# EAGLE design spiro (EAGLE 7.1.0)
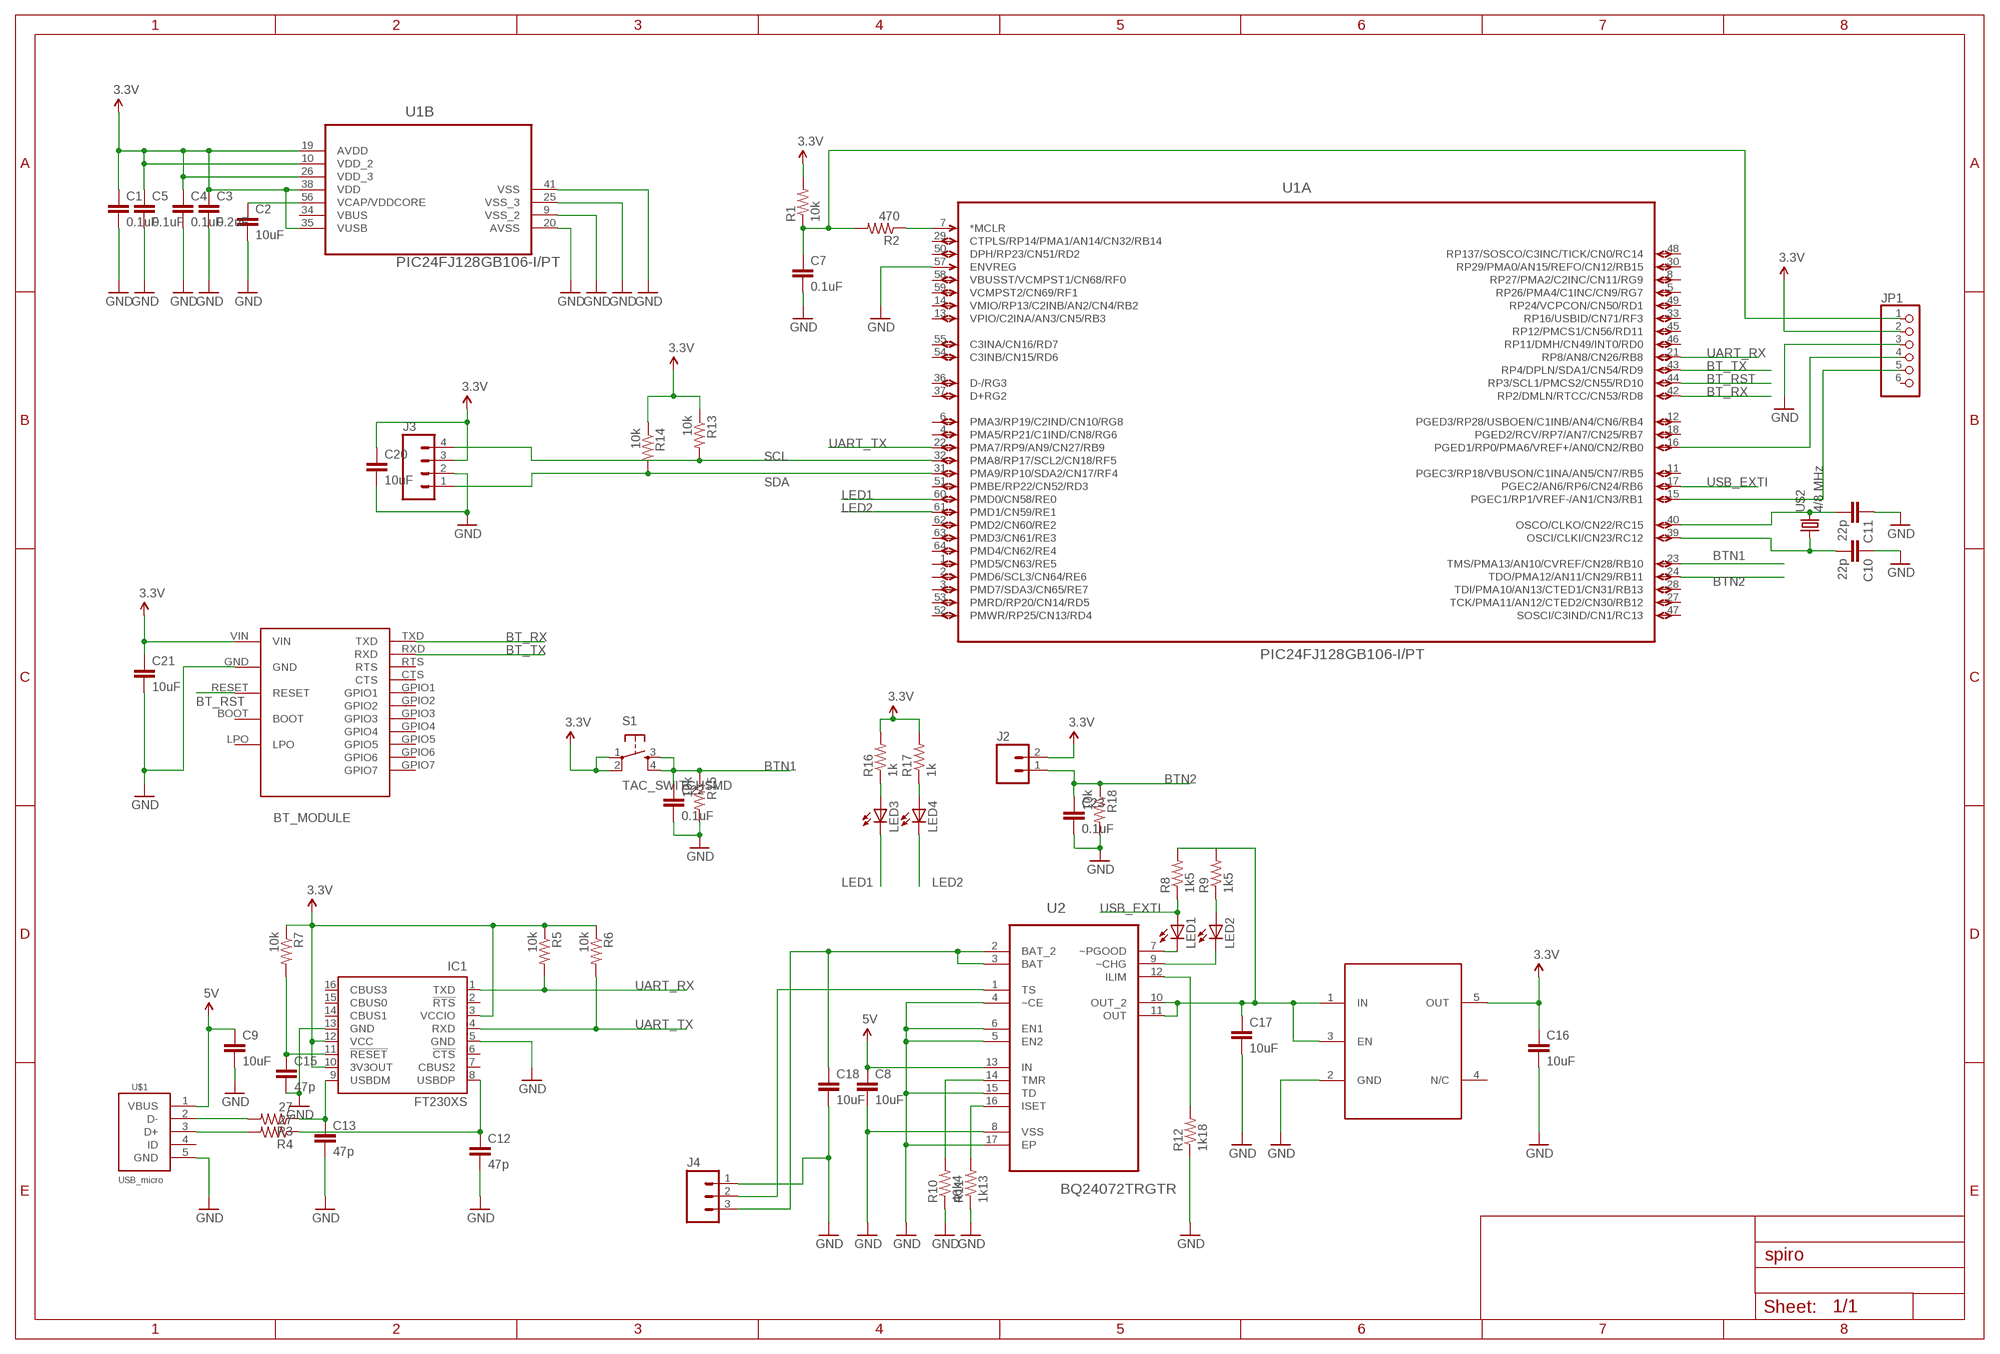
[diagram p0: schematic, sheet 1]

## Parts
BT_MODULE  BT_MODULE  SPBT2632C2A  [SPBT2632C2A]
C1  0.1uF  0.1UF-25V(+80/-20%)(0603)  [0603-CAP]
C2  10uF  10UF-6.3V-20%(1206)  [1206]
C3  0.2uF  0.1UF-25V(+80/-20%)(0603)  [0603-CAP]
C4  0.1uF  0.1UF-25V(+80/-20%)(0603)  [0603-CAP]
C5  0.1uF  0.1UF-25V(+80/-20%)(0603)  [0603-CAP]
C7  0.1uF  0.1UF-25V(+80/-20%)(0603)  [0603-CAP]
C8  10uF  10UF-6.3V-20%(1206)  [1206]
C9  10uF  10UF-6.3V-20%(1206)  [1206]
C10  22p  0.1UF-25V(+80/-20%)(0603)  [0603-CAP]
C11  22p  0.1UF-25V(+80/-20%)(0603)  [0603-CAP]
C12  47p  0.1UF-25V(+80/-20%)(0603)  [0603-CAP]
C13  47p  0.1UF-25V(+80/-20%)(0603)  [0603-CAP]
C15  47p  0.1UF-25V(+80/-20%)(0603)  [0603-CAP]
C16  10uF  10UF-6.3V-20%(1206)  [1206]
C17  10uF  10UF-6.3V-20%(1206)  [1206]
C18  10uF  10UF-6.3V-20%(1206)  [1206]
C20  10uF  10UF-6.3V-20%(1206)  [1206]
C21  10uF  10UF-6.3V-20%(1206)  [1206]
C22  0.1uF  0.1UF-25V(+80/-20%)(0603)  [0603-CAP]
C23  0.1uF  0.1UF-25V(+80/-20%)(0603)  [0603-CAP]
IC1  FT230XS  [SSOP16]
J2  M02PTH  [1X02]
J3  M04NO_SILK_ALL_ROUND  [1X04_NO_SILK_ALL_ROUND]
J4  M03  [1X03-SMD-50MILS]
JP1  PINHD-1X6  [1X06]
LED1  LEDCHIP-LED0603  [CHIP-LED0603]
LED2  LEDCHIP-LED0603  [CHIP-LED0603]
LED3  LEDCHIP-LED0603  [CHIP-LED0603]
LED4  LEDCHIP-LED0603  [CHIP-LED0603]
R1  10k  RESISTOR0603-RES  [0603-RES]
R2  470  RESISTOR0603-RES  [0603-RES]
R3  27  RESISTOR0603-RES  [0603-RES]
R4  27  RESISTOR0603-RES  [0603-RES]
R5  10k  RESISTOR0603-RES  [0603-RES]
R6  10k  RESISTOR0603-RES  [0603-RES]
R7  10k  RESISTOR0603-RES  [0603-RES]
R8  1k5  RESISTOR0603-RES  [0603-RES]
R9  1k5  RESISTOR0603-RES  [0603-RES]
R10  46k4  RESISTOR0603-RES  [0603-RES]
R11  1k13  RESISTOR0603-RES  [0603-RES]
R12  1k18  RESISTOR0603-RES  [0603-RES]
R13  10k  RESISTOR0603-RES  [0603-RES]
R14  10k  RESISTOR0603-RES  [0603-RES]
R15  10k  RESISTOR0603-RES  [0603-RES]
R16  1k  RESISTOR0603-RES  [0603-RES]
R17  1k  RESISTOR0603-RES  [0603-RES]
R18  10k  RESISTOR0603-RES  [0603-RES]
S1  TAC_SWITCHSMD  [TACTILE-SWITCH-SMD]
U1  PIC24FJ128GB106-I/PT  [QFP50P1200X1200X120-64N]
U2  BQ24072TRGTR  [QFN50P300X300X100-17N]
U$1  USB_micro  USB-CON-5PIN-105017-0001  [USB-MICRO-MOLEX-105017-0001]
U$2  4/8 MHz  CRYSTAL-2SMX  [CRYSTAL-SMD-6X3.5-2SMX]
U$3  LP3990  [SOT95P280X145-5N]

## Nets
3.3V: BT_MODULE.VIN C1.1 C3.1 C4.1 C5.1 C16.1 C20.1 C21.1 IC1.3(VCCIO) IC1.10(3V3OUT) IC1.12(VCC) J2.2 J3.3 JP1.2 R1.2 R5.1 R6.1 R7.1 R13.1 R14.1 R16.2 R17.2 S1.1 S1.2 U1.10(B:VDD_2) U1.19(B:AVDD) U1.26(B:VDD_3) U1.35(B:VUSB) U1.38(B:VDD) U$3.5(OUT)
5V: C8.1 C9.1 U2.13(IN) U$1.1(VBUS)
BT_RST: BT_MODULE.RESET U1.44(A:RP3/SCL1/PMCS2/CN55/RD10)
BT_RX: BT_MODULE.TXD U1.42(A:RP2/DMLN/RTCC/CN53/RD8)
BT_TX: BT_MODULE.RXD U1.43(A:RP4/DPLN/SDA1/CN54/RD9)
BTN1: C22.1 R15.1 S1.3 S1.4 U1.23(A:TMS/PMA13/AN10/CVREF/CN28/RB10)
BTN2: C23.1 J2.1 R18.1 U1.24(A:TDO/PMA12/AN11/CN29/RB11)
GND: BT_MODULE.GND C1.2 C2.2 C3.2 C4.2 C5.2 C7.2 C8.2 C9.2 C10.1 C11.1 C12.2 C13.2 C15.2 C16.2 C17.2 C18.2 C20.2 C21.2 C22.2 C23.2 IC1.5(GND) IC1.13(GND) J3.2 J4.1 JP1.3 R10.1 R11.1 R12.1 R15.2 R18.2 U1.9(B:VSS_2) U1.20(B:AVSS) U1.25(B:VSS_3) U1.41(B:VSS) U1.57(A:ENVREG) U2.4(~CE) U2.5(EN2) U2.6(EN1) U2.8(VSS) U2.15(TD) U2.17(EP) U$1.5(GND) U$3.2(GND)
LED1: LED3.C U1.60(A:PMD0/CN58/RE0)
LED2: LED4.C U1.61(A:PMD1/CN59/RE1)
N$1: C2.1 U1.56(B:VCAP/VDDCORE)
N$2: R4.2 U$1.3(D+)
N$3: C13.1 IC1.9(USBDM) R3.1
N$4: C12.1 IC1.8(USBDP) R4.1
N$5: R3.2 U$1.2(D-)
N$6: LED1.C U2.7(~PGOOD)
N$7: C7.1 JP1.1 R1.1 R2.2
N$8: R2.1 U1.7(A:*MCLR)
N$9: C11.2 U1.40(A:OSCO/CLKO/CN22/RC15) U$2.P$3
N$11: JP1.4 U1.16(A:PGED1/RP0/PMA6/VREF+/AN0/CN2/RB0)
N$12: C10.2 U1.39(A:OSCI/CLKI/CN23/RC12) U$2.P$1
N$13: JP1.5 U1.15(A:PGEC1/RP1/VREF-/AN1/CN3/RB1)
N$14: C17.1 R8.2 R9.2 U2.10(OUT_2) U2.11(OUT) U$3.1(IN) U$3.3(EN)
N$15: C15.1 IC1.11(!RESET) R7.2
N$16: LED2.A R9.1
N$17: J4.2 U2.1(TS)
N$18: C18.1 J4.3 U2.2(BAT_2) U2.3(BAT)
N$19: LED2.C U2.9(~CHG)
N$21: R11.2 U2.16(ISET)
N$22: R12.2 U2.12(ILIM)
N$23: R10.2 U2.14(TMR)
N$24: LED3.A R16.1
N$28: LED4.A R17.1
SCL: J3.4 R13.2 U1.32(A:PMA8/RP17/SCL2/CN18/RF5)
SDA: J3.1 R14.2 U1.31(A:PMA9/RP10/SDA2/CN17/RF4)
UART_RX: IC1.1(TXD) R5.2 U1.21(A:RP8/AN8/CN26/RB8)
UART_TX: IC1.4(RXD) R6.2 U1.22(A:PMA7/RP9/AN9/CN27/RB9)
USB_EXTI: LED1.A R8.1 U1.17(A:PGEC2/AN6/RP6/CN24/RB6)
Unconnected: BT_MODULE.BOOT BT_MODULE.CTS BT_MODULE.GPIO1 BT_MODULE.GPIO2 BT_MODULE.GPIO3 BT_MODULE.GPIO4 BT_MODULE.GPIO5 BT_MODULE.GPIO6 BT_MODULE.GPIO7 BT_MODULE.LPO BT_MODULE.RTS IC1.2(!RTS) IC1.6(!CTS) IC1.7(CBUS2) IC1.14(CBUS1) IC1.15(CBUS0) IC1.16(CBUS3) JP1.6 U1.1(A:PMD5/CN63/RE5) U1.2(A:PMD6/SCL3/CN64/RE6) U1.3(A:PMD7/SDA3/CN65/RE7) U1.4(A:PMA5/RP21/C1IND/CN8/RG6) U1.5(A:RP26/PMA4/C1INC/CN9/RG7) U1.6(A:PMA3/RP19/C2IND/CN10/RG8) U1.8(A:RP27/PMA2/C2INC/CN11/RG9) U1.11(A:PGEC3/RP18/VBUSON/C1INA/AN5/CN7/RB5) U1.12(A:PGED3/RP28/USBOEN/C1INB/AN4/CN6/RB4) U1.13(A:VPIO/C2INA/AN3/CN5/RB3) U1.14(A:VMIO/RP13/C2INB/AN2/CN4/RB2) U1.18(A:PGED2/RCV/RP7/AN7/CN25/RB7) U1.27(A:TCK/PMA11/AN12/CTED2/CN30/RB12) U1.28(A:TDI/PMA10/AN13/CTED1/CN31/RB13) U1.29(A:CTPLS/RP14/PMA1/AN14/CN32/RB14) U1.30(A:RP29/PMA0/AN15/REFO/CN12/RB15) U1.33(A:RP16/USBID/CN71/RF3) U1.36(A:D-/RG3) U1.37(A:D+RG2) U1.45(A:RP12/PMCS1/CN56/RD11) U1.46(A:RP11/DMH/CN49/INT0/RD0) U1.47(A:SOSCI/C3IND/CN1/RC13) U1.48(A:RP137/SOSCO/C3INC/TICK/CN0/RC14) U1.49(A:RP24/VCPCON/CN50/RD1) U1.50(A:DPH/RP23/CN51/RD2) U1.51(A:PMBE/RP22/CN52/RD3) U1.52(A:PMWR/RP25/CN13/RD4) U1.53(A:PMRD/RP20/CN14/RD5) U1.54(A:C3INB/CN15/RD6) U1.55(A:C3INA/CN16/RD7) U1.58(A:VBUSST/VCMPST1/CN68/RF0) U1.59(A:VCMPST2/CN69/RF1) U1.62(A:PMD2/CN60/RE2) U1.63(A:PMD3/CN61/RE3) U1.64(A:PMD4/CN62/RE4) U$1.4(ID) U$3.4(N/C)

## Notes on the sheet
- BT_MODULE

## Power pins joined to a net without a drawn wire
VBUS: U1.34(B:VBUS)

## Library data of the parts
BT_MODULE = SPBT2632C2A:SPBT2632C2A
C1 C4 C5 C7 C22 C23 = SparkFun-Capacitors:0.1UF-25V(+80/-20%)(0603): CAP-00810 Ceramic Standard decoupling cap; PROD_ID: CAP-00810
C2 C8 C9 C16-C18 C20 C21 = SparkFun-Capacitors:10UF-6.3V-20%(1206): CAP-10057 Ceramic; PROD_ID: CAP-10057
C3 C10-C13 C15 = SparkFun-Capacitors:0.1UF-25V(+80/-20%)(0603): CAP-00810 Ceramic Standard decoupling cap; PROD_ID: CAP-00810; VALUE: 0.1uF
IC1 = ftdi:FT230X: USB to BASIC UART IC Auto generated by make-symbol-device-package-bsdl.ulp Rev. 43 Source: Data sheet <http://www.ftdichip.com/Support/Documents/DataSheets/ICs/DS_FT230X.pdf>
J2 = SparkFun-Connectors:M02: Standard 2-pin 0.1" header. Use with - straight break away headers ( PRT-00116) - right angle break away headers (PRT-00553) - swiss pins (PRT-00743) - machine pins (PRT-00117) - female headers (PRT-00115) Molex polarized connector foot print use with: PRT-08233 with associated crimp pins and housings. 2.54_SCREWTERM for use with PRT-10571. 3.5mm Screw Terminal footprints for PRT-08084 5mm Screw Terminal footprints for use with PRT-08432
J3 = SparkFun-Connectors:M04: Header 4 Standard 4-pin 0.1" header. Use with straight break away headers (SKU : PRT-00116), right angle break away headers (PRT-00553), swiss pins (PRT-00743), machine pins (PRT-00117), and female headers (PRT-00115). Molex polarized connector foot print use with SKU : PRT-08231 with associated crimp pins and housings. 1MM SMD Version SKU: PRT-10208; PROD_ID: CONN-09696
J4 = SparkFun-Connectors:M03: Header 3 Standard 3-pin 0.1" header. Use with straight break away headers (SKU : PRT-00116), right angle break away headers (PRT-00553), swiss pins (PRT-00743), machine pins (PRT-00117), and female headers (PRT-00115). Molex polarized connector foot print use with SKU : PRT-08232 with associated crimp pins and housings.
JP1 = adafruit:PINHD-1X6: PIN HEADER
LED1-LED4 = adafruit:LED: LED OSRAM: - CHIPLED LG R971, LG N971, LY N971, LG Q971, LY Q971, LO R971, LY R971 LH N974, LH R974 LS Q976, LO Q976, LY Q976 LO Q996 - Hyper CHIPLED LW Q18S LB Q993, LB Q99A, LB R99A - SideLED LS A670, LO A670, LY A670, LG A670, LP A670 LB A673, LV A673, LT A673, LW A673 LH A674 LY A675 LS A676, LA A676, LO A676, LY A676, LW A676 LS A679, LY A679, LG A679 - Hyper Micro SIDELED® LS Y876, LA Y876, LO Y876, LY Y876 LT Y87S - SmartLED LW L88C, LW L88S LB L89C, LB L89S, LG L890 LS L89K, LO L89K, LY L89K LS L896, LA L896, LO L896, LY L896 - TOPLED LS T670, LO T670, LY T670, LG T670, LP T670 LSG T670, LSP T670, LSY T670, LOP T670, LYG T670 LG T671, LOG T671, LSG T671 LB T673, LV T673, LT T673, LW T673 LH T674 LS T676, LA T676, LO T676, LY T676, LB T676, LH T676, LSB T676, LW T676 LB T67C, LV T67C, LT T67C, LS T67K, LO T67K, LY T67K, LW E67C LS E67B, LA E67B, LO E67B, LY E67B, LB E67C, LV E67C, LT E67C LW T67C LS T679, LY T679, LG T679 LS T770, LO T770, LY T770, LG T770, LP T770 LB T773, LV T773, LT T773, LW T773 LH T774 LS E675, LA E675, LY E675, LS T675 LS T776, LA T776, LO T776, LY T776, LB T776 LHGB T686 LT T68C, LB T68C - Hyper Mini TOPLED® LB M676 - Mini TOPLED Santana® LG M470 LS M47K, LO M47K, LY M47K Source: http://www.osram.convergy.de/
R1-R18 = SparkFun-Passives:RESISTOR: Resistor Basic schematic elements and footprints for 0603, 1206, and PTH resistors.
S1 = SparkFun-Retired:TAC_SWITCH: Momentary Switch Button commonly used for reset or general input. Spark Fun Electronics SKU : COM-00097 SMT- SWCH-08247; PROD_ID: SWCH-08247
U1 = Microchip_By_element14_Batch_1:PIC24FJ128GB106-I/PT: IC, 16BIT MCU; MPN: PIC24FJ128Gb106-I/PT; OC_FARNELL: 1576850; OC_NEWARK: 54M5097; PACKAGE: TQFP-64; SUPPLIER: Microchip
U2 = Texas Instruments_By_element14_Batch_1:BQ24072TRGTR: 1.5A USB-Friendly Li-Ion Battery Charger and Power-Path Management IC; MPN: BQ24072TRGTR; OC_FARNELL: -; OC_NEWARK: 74R6078; PACKAGE: QFN-16; SUPPLIER: Texas Instruments
U$1 = GeekAmmo:USB-CON-5PIN: Molex Micro USB 105017-0001
U$2 = SparkFun-FreqCtrl:CRYSTAL-2SMX
U$3 = Texas Instruments_By_element14_Batch_1:LP3990

## Board
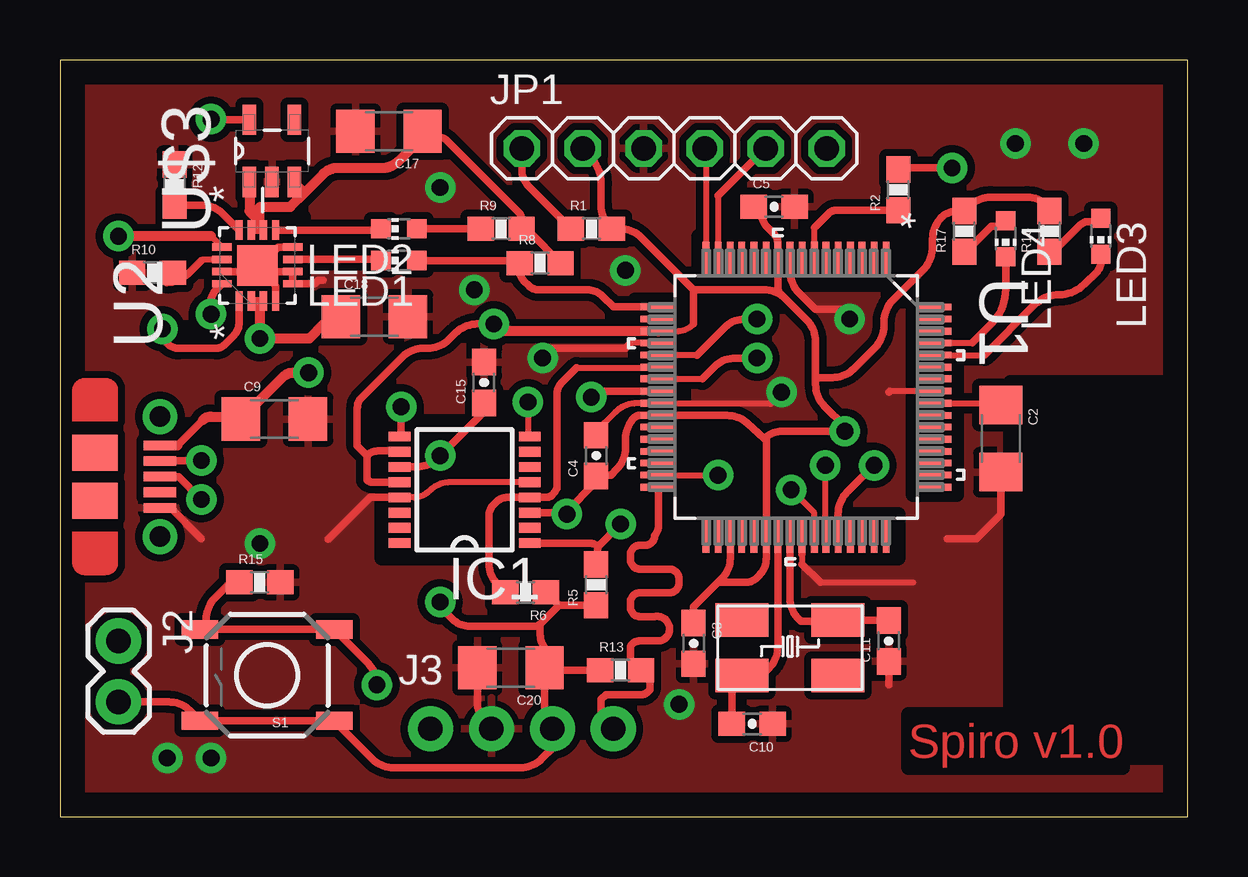
[diagram p1: board, top side]
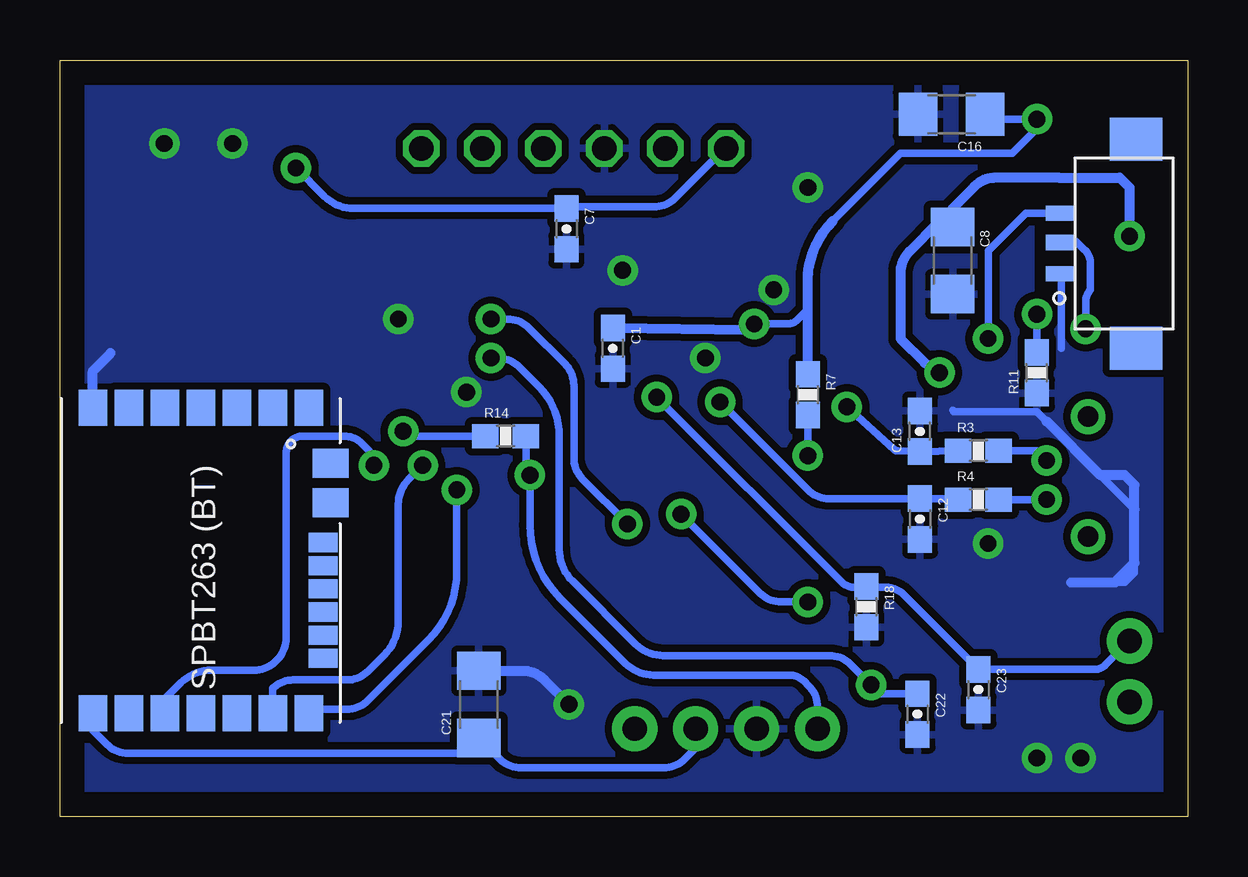
[diagram p2: board, bottom side, seen from below]

Size 47.02 x 31.52 mm. Coordinates in mm from the lower left corner, seen from the top.
Outline: 0,0 47.02,0 47.02,31.52 0,31.52 0,0
Copper layers (1*16): Top 0.035mm / dielectric 1.5mm / Bottom 0.035mm
Design rules "default": minimum track width 10mil, minimum drill 24mil, track to track 8mil, track to pad 8mil, pad to pad 8mil, via to via 8mil, smd to smd 8mil, copper to edge 40mil, drill to drill 8mil, minimum pad ring 10mil, minimum via ring 8mil, stop-mask expansion 4mil, vias tented up to drill 0mil, thermal gap 10mil
tRestrict: area 6.3,20.9 to 10.2,25; area 13.4,10.8 to 20.3,16.5; area 39.6,3.5 to 46.5,18.1; area 26.6,22.1 to 35,24.2; area 24,13.4 to 26,21.5; area 26.6,10.8 to 35,12.6; area 35.6,13.4 to 37.4,21.5; area 35.4,2 to 44.3,4.3; area 20.9,13.4 to 24.2,17.5
bRestrict: area 39.6,4.1 to 46.5,17.1; area 0.2,21.1 to 6.1,27.2

### Footprints (pad centres in the part's own frame; a part is rotated, then mirrored left to right if it is on the bottom)
SPBT2632C2A = smd 1.2 x 1.5: BOOT 3,6.37; CTS 0,6.37; GND 4.5,-6.37; GPIO1 -4.5,-6.37; GPIO2 -3,-6.37; GPIO3 -1.5,-6.37; GPIO4 0,-6.37; GPIO5 1.5,-6.37; GPIO6 3,-6.37; RESET 1.5,6.37; RTS -1.5,6.37; RXD -3,6.37; TXD -4.5,6.37; VIN 4.5,6.37 | smd 1.5 x 1.2: GPIO7 -5.4,-4.05; LPO -5.4,-2.4 | smd 1.2 x 0.8: NC -5.1,4.075; NC1 -5.1,3.11; NC2 -5.1,2.145; NC3 -5.1,1.18; NC4 -5.1,0.215; NC5 -5.1,-0.75
0603-CAP = smd 1.1 x 1: 1 -0.85,0; 2 0.85,0
1206 = smd 1.6 x 1.8: 1 -1.4,0; 2 1.4,0
SSOP16 = smd 0.914 x 0.406: 1 -2.718,2.223; 2 -2.718,1.587; 3 -2.718,0.953; 4 -2.718,0.318; 5 -2.718,-0.318; 6 -2.718,-0.953; 7 -2.718,-1.587; 8 -2.718,-2.223; 9 2.718,-2.223; 10 2.718,-1.587; 11 2.718,-0.953; 12 2.718,-0.318; 13 2.718,0.318; 14 2.718,0.953; 15 2.718,1.587; 16 2.718,2.223
1X02 = drill 1.016 pad 1.88: 1 0,0; 2 2.54,0
1X04_NO_SILK_ALL_ROUND = drill 1.016 pad 1.88: 1 0,0; 2 2.54,0; 3 5.08,0; 4 7.62,0
1X03-SMD-50MILS = smd 0.635 x 1.27: 1 2.299,4.674; 2 3.599,4.674; 3 4.813,4.674 | smd 1.803 x 2.184: MEC1 -0.813,1.549; MEC2 7.899,1.549
1X06 = drill 1.016 octagon: 1 -6.35,0; 2 -3.81,0; 3 -1.27,0; 4 1.27,0; 5 3.81,0; 6 6.35,0
CHIP-LED0603 = smd 0.8 x 0.8: A 0,-0.75; C 0,0.75
0603-RES = smd 1.1 x 1: 1 -0.85,0; 2 0.85,0
TACTILE-SWITCH-SMD = smd 1.524 x 0.762: 1 -2.794,1.905; 2 2.794,1.905; 3 -2.794,-1.905; 4 2.794,-1.905
QFP50P1200X1200X120-64N = smd 1.473 x 0.279: 1 -5.74,3.759; 2 -5.74,3.251; 3 -5.74,2.743; 4 -5.74,2.261; 5 -5.74,1.753; 6 -5.74,1.245; 7 -5.74,0.762; 8 -5.74,0.254; 9 -5.74,-0.254; 10 -5.74,-0.762; 11 -5.74,-1.245; 12 -5.74,-1.753; 13 -5.74,-2.261; 14 -5.74,-2.743; 15 -5.74,-3.251; 16 -5.74,-3.759; 33 5.74,-3.759; 34 5.74,-3.251; 35 5.74,-2.743; 36 5.74,-2.261; 37 5.74,-1.753; 38 5.74,-1.245; 39 5.74,-0.762; 40 5.74,-0.254; 41 5.74,0.254; 42 5.74,0.762; 43 5.74,1.245; 44 5.74,1.753; 45 5.74,2.261; 46 5.74,2.743; 47 5.74,3.251; 48 5.74,3.759 | smd 0.279 x 1.473: 17 -3.759,-5.74; 18 -3.251,-5.74; 19 -2.743,-5.74; 20 -2.261,-5.74; 21 -1.753,-5.74; 22 -1.245,-5.74; 23 -0.762,-5.74; 24 -0.254,-5.74; 25 0.254,-5.74; 26 0.762,-5.74; 27 1.245,-5.74; 28 1.753,-5.74; 29 2.261,-5.74; 30 2.743,-5.74; 31 3.251,-5.74; 32 3.759,-5.74; 49 3.759,5.74; 50 3.251,5.74; 51 2.743,5.74; 52 2.261,5.74; 53 1.753,5.74; 54 1.245,5.74; 55 0.762,5.74; 56 0.254,5.74; 57 -0.254,5.74; 58 -0.762,5.74; 59 -1.245,5.74; 60 -1.753,5.74; 61 -2.261,5.74; 62 -2.743,5.74; 63 -3.251,5.74; 64 -3.759,5.74
QFN50P300X300X100-17N = smd 0.813 x 0.305: 1 -1.473,0.762; 2 -1.473,0.254; 3 -1.473,-0.254; 4 -1.473,-0.762; 9 1.473,-0.762; 10 1.473,-0.254; 11 1.473,0.254; 12 1.473,0.762 | smd 0.305 x 0.813: 5 -0.762,-1.473; 6 -0.254,-1.473; 7 0.254,-1.473; 8 0.762,-1.473; 13 0.762,1.473; 14 0.254,1.473; 15 -0.254,1.473; 16 -0.762,1.473 | smd 1.702 x 1.702: 17 0,0
USB-MICRO-MOLEX-105017-0001 = smd 0.4 x 1.35: 1 1.2,0; 2 1.85,0; 3 2.5,0; 4 3.15,0; 5 3.8,0 | drill 0.85 pad 1.45: P$1 0,0; P$2 5,0 | smd 1.5 x 1.9: P$3 3.5,-2.7; P$4 1.5,-2.7
CRYSTAL-SMD-6X3.5-2SMX = smd 2.2 x 1.4: P$1 1,0.6; P$2 5,0.6; P$3 5,2.9; P$4 1,2.9
SOT95P280X145-5N = smd 1.27 x 0.559: 1 -1.295,0.94; 2 -1.295,0; 3 -1.295,-0.94; 4 1.295,-0.94; 5 1.295,0.94

### Placement (x,y rotation side)
BT_MODULE  41.15,10.67 180 bottom
C1  23.98,19.51 270 bottom
C2  39.22,15.75 270 top
C3  26.42,7.21 270 top
C4  22.35,15.04 90 top
C5  29.77,25.4 0 top
C7  25.91,24.49 270 bottom
C8  9.81,23.17 270 bottom
C9  8.94,16.56 0 top
C10  28.85,3.86 180 top
C11  34.54,7.32 90 top
C12  11.18,12.4 270 bottom
C13  11.18,16.05 90 bottom
C15  17.68,18.08 90 top
C16  9.86,29.26 180 bottom
C17  13.72,28.55 180 top
C18  13.11,20.83 0 top
C20  18.8,6.2 180 top
C21  29.57,4.67 90 bottom
C22  11.28,4.27 270 bottom
C23  8.74,5.28 270 bottom
IC1  16.87,13.61 180 top
J2  2.44,7.32 270 top
J3  15.44,3.66 0 top
J4  0.61,20.32 90 bottom
JP1  25.6,27.84 0 top
LED1  14.12,23.16 90 top
LED2  14.12,24.49 90 top
LED3  43.38,24.18 180 top
LED4  39.42,24.08 180 top
R1  22.15,24.49 0 top
R2  34.95,26.11 90 top
R3  8.74,15.24 0 bottom
R4  8.74,13.21 0 bottom
R5  22.35,9.65 90 top
R6  19.41,9.35 180 top
R7  15.85,17.58 270 bottom
R8  20.02,23.06 0 top
R9  18.39,24.49 0 top
R10  3.86,22.66 0 top
R11  6.3,18.49 90 bottom
R12  4.78,26.31 270 top
R13  23.37,6.1 0 top
R14  28.45,15.85 0 bottom
R15  8.33,9.75 0 top
R16  41.25,24.38 90 top
R17  37.69,24.38 90 top
R18  13.41,8.74 270 bottom
S1  8.64,5.89 180 top
U1  30.68,17.48 270 top
U2  8.23,22.96 90 top
U$1  4.17,16.66 270 top
U$2  27.43,5.28 0 top
U$3  8.84,27.74 90 top

### Tracks (layer width: path | path; a pad name or v marks a point on that pad's centre or on a via)
3.3V  (via drill 0.7 pad 1.27)
  Top 0.203: U1.38 29.46,11.71 29.46,10.97
  Top 0.254: U1.19 25.68,20.22 arc45 26.42,20.52
  Top 0.305: U$3.5 6.53,29.03 v6.3,29.06 | C20.1 20.2,4.7 arc45 20.52,3.91 J3.3 20.52,2.95 20.57,2.9 20.08,2.4 arc-45 19.18,2.03 13.91,2.03 arc-45 13.01,2.4 S1.1 S1.2 5.43,4.4 arc45 4.53,4.78 J2.2 | 29.36,15.75 28.66,16.39 arc42 27.81,16.71 U1.26 24.15,16.71 arc45 23.94,16.63 arc45 23.57,15.73 23.57,15.36 arc-45 23.2,14.46 22.96,14.22 22.39,14.22 C4.1 22.35,13.95 21.07,12.66 | R16.2 41.25,25.4 41.22,25.43 arc45 40.32,25.81 38.79,25.81 arc45 37.89,25.43 R17.2 37.41,25.23 arc45 36.74,24.96 arc45 36.37,24.06 36.37,23.78 arc-45 35.94,22.73 34.71,21.5 arc45 34.34,20.61 34.34,20.44 arc-45 33.97,19.54 33.09,18.66 arc-45 32.19,18.29 31.5,18.29 | JP1.2 21.79,27.79 22.1,27.48 arc-45 22.55,26.39 22.55,25.45 arc45 22.93,24.56 R1.2 23.35,24.49 arc-45 24.25,24.11 26.42,21.95 | 26.42,21.95 29.34,21.95 arc-45 30.24,21.57 | 30.24,21.57 31.12,20.69 arc-45 31.5,19.79 31.5,18.29 | 31.5,18.29 31.5,18 arc45 31.87,17.1 32.72,16.26 v32.72,16.05 | 26.42,21.95 26.42,20.52 | v21.13,12.6 21.07,12.66 | 21.07,12.66 IC1.3 | R6.1 20.8,8.8 | 20.8,8.8 R5.1 22.19,8.8 | C20.1 20.3,6.91 arc-45 20.02,7.58 20.02,8.02 | C20.1 20.3,6.1 R13.1 | 20.8,8.8 20.02,8.02 | 20.02,8.02 arc-45 19.79,7.92 17.08,7.92 arc-45 16.36,8.22 15.85,8.74 v15.85,8.94 | IC1.12 13.02,13.93 arc-45 12.8,14.02 12.8,15.04 | 12.8,15.04 arc-45 13.29,15.24 14.11,15.24 IC1.10 | 12.8,15.04 12.39,15.44 12.39,17.03 arc-45 12.56,17.44 14.27,19.14 arc-45 15.14,19.51 15.32,19.51 arc45 16.23,19.88 16.49,20.15 arc-45 17.39,20.52 v18.09,20.52 | 29.36,15.75 29.44,15.67 U1.38 29.44,10.76 arc-45 29.14,10.04 29.04,9.94 arc-45 28.59,9.75 27.43,9.75
  Top 0.305: 29.36,15.75 arc-45 30.1,16.05 v32.72,16.05 | 32.92,15.85 v32.72,16.05 | C3.1 26.42,8.74 27.43,9.75 | U1.35 27.94,10.77 arc-45 27.58,9.9 27.43,9.75 | C5.1 29.26,25.06 29.26,25.06 arc45 29.45,24.6 29.74,24.31 arc-45 29.92,23.88 U1.10 29.92,22.05 arc45 30.04,21.78 30.24,21.57
  Top 0.406: 18.39,20.22 arc-90 v18.09,20.52 arc90 18.39,20.22 | U1.19 18.39,20.22
  Bottom 0.305: BT_MODULE.VIN 45.65,3.59 45.08,3.01 arc-45 44.18,2.64 30.2,2.64 C21.1 28.7,2.4 arc-45 27.8,2.03 21.86,2.03 arc-45 20.96,2.4 20.52,2.85 J3.3 | 29.5,16.05 R14.1 32.23,15.85 arc45 v32.72,16.05 | v15.85,8.94 16.95,8.94 arc45 17.85,9.31 v21.13,12.6 | v18.09,20.52 16.7,20.52 arc-45 16.29,20.69 15.85,21.13 | 14.81,24.82 11.99,27.64 7.32,27.64 6.3,28.65 v6.3,29.06 8.25,29.06 C16.1
  Bottom 0.406: R7.1 15.85,21.13 15.85,22.3 arc45 14.81,24.82 | C1.1 18.32,20.28 arc-90 v18.09,20.52
5V  (via drill 0.7 pad 1.27)
  Top 0.254: 6.3,24.18 U2.13
  Top 0.305: 4.9,15.46 5.96,16.53 | 7.44,16.66 C9.1
  Top 0.406: 6.3,24.18 v2.44,24.18 | U$1.1 4.9,15.46 | 5.96,16.53 arc-45 6.28,16.66 7.44,16.66 | C9.1 9.29,18.31 arc-45 9.73,18.49 v10.36,18.49
  Bottom 0.406: v2.44,24.18 2.44,26.21 2.85,26.62 5.4,26.62 8.01,26.62 arc-45 8.91,26.25 9.81,25.34 C8.1 10.42,24.73 11.62,23.54 arc-45 11.99,22.64 11.99,19.91 10.97,18.9 v10.36,18.49
BT_RST  (via drill 0.7 pad 1.27)
  Top 0.305: U1.44 32.44,12.61 arc-45 32.81,13.5 v33.93,14.63
  Bottom 0.305: BT_MODULE.RESET 42.65,4.9 41.98,5.56 arc45 40.7,6.1 38.93,6.1 arc-45 38.03,6.47 37.96,6.54 arc-45 37.59,7.43 37.59,15.14 arc45 37.38,15.66 arc45 36.91,15.85 35.18,15.85 arc45 34.44,15.55 34.14,15.24 34.14,14.83 v33.93,14.63
BT_RX  (via drill 0.7 pad 1.27)
  Top 0.254: U1.42 31.45,12.65 v30.48,13.61
  Bottom 0.305: v30.48,13.61 30.48,10.22 arc45 31.67,7.34 34.17,4.84 arc45 35.07,4.47 36.48,4.47 BT_MODULE.TXD
BT_TX  (via drill 0.7 pad 1.27)
  Top 0.203: 31.9,11.76 U1.43
  Top 0.254: 31.9,11.76 v31.9,14.63
  Bottom 0.305: v31.9,14.63 32.49,14.04 arc-45 32.92,13.01 32.92,8.14 arc45 33.51,6.73 34.17,6.06 arc45 35.07,5.69 37.3,5.69 arc-45 38.15,5.34 BT_MODULE.RXD
BTN1  (via drill 0.7 pad 1.27)
  Top 0.254: U1.23 26.77,18.24
  Top 0.305: v13.21,5.49 v13.21,5.49 arc45 12.84,6.39 S1.3 S1.4 6.1,8.05 6.1,8.21 arc-45 6.47,9.11 7.11,9.75 R15.1 | 26.77,18.24 27.26,18.73 arc-45 28.16,19.1 v29.06,19.1
  Bottom 0.305: v13.21,5.49 14.05,6.33 arc-45 14.95,6.71 21.88,6.71 arc45 23.04,7.18 25.66,9.81 arc45 26.21,11.14 26.21,15.87 arc-45 27.06,17.91 27.87,18.73 arc-45 28.77,19.1 v29.06,19.1 | 13.04,5.32 v13.21,5.49 | C22.1 12.84,5.12 v13.21,5.49
BTN2  (via drill 0.7 pad 1.27)
  Top 0.305: v22.15,17.48 22.4,17.73 U1.24
  Bottom 0.305: J2.1 3.44,6.32 arc45 3.88,6.13 C23.1 11.85,9.24 arc-45 12.59,9.55 13.37,9.55 R18.1 13.41,9.55 13.88,9.55 arc45 14.47,9.8 v22.15,17.48
GND  (via drill 0.7 pad 1.27)
  Top 0.254: U1.20 23.8,19.74 | 29.62,17.22 U1.25 24.05,17.22 arc45 23.15,16.85 22.35,16.05 | U1.57 34.59,17.73 | U1.41 30.94,10.52 | 31.7,9.75 35.56,9.75 | IC1.13 14.75,13.3 arc45 15.39,13.56 arc-45 16.29,13.93 IC1.5
  Top 0.305: J3.2 17.77,3.87 arc-45 17.4,4.77 C20.2 | U$1.5 4.61,12.86 5.89,11.58 | 36.98,11.58 38.2,11.58 39.22,12.6 C2.2 | 23.8,19.74 23.57,19.51 20.52,19.51 | U1.9 30.43,22.73 arc45 30.8,21.83 31.5,21.13 32.92,21.13 | 29.62,17.22 v30.07,17.68 | 34.54,5.49 C11.1 | U1.41 30.94,10.92 | 34.59,17.73 34.54,17.68 | 30.94,10.52 31.7,9.75 | U2.15 7.98,22.71 U2.17 8.48,22.71 8.74,22.71 | 8.74,22.71 8.94,22.71 | 8.94,22.71 U2.6 U2.5 10.62,22.2 10.77,22.35 10.97,22.35 | U2.8 9.09,23.72 8.74,23.37 8.74,22.71 | U2.4 8.99,22.1 8.94,22.15 8.94,22.71 | IC1.13 12.93,13.3 C12.2 | C4.2 22.35,16.05
  Top 0.406: v25.81,4.67 25.81,4.47
  Bottom 0.305: v30.07,17.68 29.87,17.68 | 9.81,16.92 9.75,16.87 6.3,16.87 2.23,12.8 2.23,10.16 2.64,9.75 4.88,9.75 | J4.1 5.28,19.51
  Bottom 0.406: 4.88,9.75 3.05,9.75 2.23,10.57 2.23,12.8 2.23,13.82 2.64,14.22 3.66,14.22 5.89,16.46 | C21.2 27.73,6.07 arc45 26.83,5.7 v25.81,4.67 | BT_MODULE.GND 45.65,18.56 44.91,19.3
  other vias: 23.57,22.76 20.12,19.1 32.92,20.73 39.83,28.04 15.85,26.21 4.47,2.44 6.3,2.44 8.33,11.38 42.67,28.04 17.27,21.95
  pour Bottom (isolate 0.305): -1.63,33.53 -1.63,-1.83 49.78,-1.83 49.78,33.53 -1.42,33.53
  pour Top (isolate 0.305): -1.63,33.32 -1.63,-1.83 49.58,-1.83 49.58,33.53 -1.63,33.53
LED1
  Top 0.254: U1.60 38.53,19.23
  Top 0.305: LED3.C 43.38,23.07 arc-45 43.23,22.71 42.7,22.18 arc-45 41.65,21.74 arc45 40.62,21.31 38.53,19.23
LED2
  Top 0.254: U1.61 38.02,19.74
  Top 0.305: LED4.C 39.42,21.97 arc-45 38.83,20.54 38.02,19.74
N$1
  Top 0.254: U1.56 39.14,17.22
  Top 0.305: 39.14,17.22 C2.1
N$2  (via drill 0.7 pad 1.27)
  Top 0.305: U$1.3 4.94,14.16 v5.89,13.21
  Bottom 0.305: v5.89,13.21 R4.2
N$3  (via drill 0.7 pad 1.27)
  Top 0.305: v14.22,17.07 14.22,15.91 IC1.9
  Bottom 0.305: 13.86,17.27 v14.22,17.07 12.25,15.29 arc-40 12.12,15.24 C13.1 R3.1
N$4  (via drill 0.7 pad 1.27)
  Top 0.254: v19.51,17.27 19.51,15.91 IC1.8
  Bottom 0.305: R4.1 9.83,13.24 C12.1 14.96,13.24 arc45 15.85,13.62 v19.51,17.27
N$5  (via drill 0.7 pad 1.27)
  Top 0.305: U$1.2 4.19,14.83 v5.89,14.83
  Bottom 0.305: v5.89,14.83 6.3,15.24 R3.2
N$6
  Top 0.305: U2.7 13.32,23.22 LED1.C
N$7  (via drill 0.7 pad 1.27)
  Top 0.305: R1.1 19.57,26.22 arc-45 19.25,26.98 JP1.1 | v37.19,27.03 35.02,27.03 R2.2
  Bottom 0.305: JP1.1 19.3,27.84 21.37,25.77 arc45 22.27,25.4 25.84,25.4 C7.1 34.78,25.34 arc45 36,25.84 v37.19,27.03
N$8
  Top 0.254: U1.7 31.45,24.54
  Top 0.305: R2.1 32.37,25.26 arc45 32.03,25.12 31.45,24.54
N$9
  Top 0.305: U1.40 30.43,9.11 arc45 30.8,8.21 30.89,8.13 32.38,8.13 U$2.P$3 34.53,8.18 C11.2
N$11
  Top 0.254: 26.92,27.79 U1.16
  Top 0.305: JP1.4 26.92,27.79
N$12
  Top 0.305: U1.39 29.92,7.08 arc-45 29.55,6.18 29.06,5.69 28.63,5.69 U$2.P$1 | U$2.P$1 28,5.46 C10.2 | 28.42,5.89 U$2.P$1
N$13
  Top 0.254: 27.43,25.86 U1.15
  Top 0.305: JP1.5 27.43,25.86
N$14
  Top 0.305: U2.11 U2.10 8.33,24.59 8.33,24.79 8.13,24.59 | U$3.1 7.9,25.43 | U$3.3 10.21,26.01 | 18.9,24.55 R9.2 | C17.1 15.12,28.32 15.68,28.32 arc-45 16.18,28.12 19.05,25.25 arc-45 19.3,24.64 19.3,24.55 R9.2 | R9.2 R9.2 arc-45 19.58,24.34 R8.2
  Top 0.406: U$3.1 7.9,25.22 8.33,24.79 8.33,25.4 9.6,25.4 10.21,26.01 10.98,26.78 arc-45 11.57,27.03 13.44,27.03 arc45 14.08,27.29 15.12,28.32
N$15  (via drill 0.7 pad 1.27)
  Top 0.305: IC1.11 14.85,14.57 arc45 15.75,14.94 v15.85,15.04 17.68,16.87 C15.1
  Bottom 0.305: v15.85,15.04 R7.2
N$16
  Top 0.305: LED2.A R9.1
N$17  (via drill 0.7 pad 1.27)
  Top 0.305: U2.1 7.47,20.59 arc-45 7.24,20.04 6.84,19.64 arc-45 6.52,19.51 4.94,19.51 arc-45 4.49,19.7 4.27,19.91 v4.27,20.32
  Bottom 0.305: v4.27,20.32 4.27,21.45 arc45 4.06,21.95 4.06,23.01 arc-45 4.32,23.62 4.67,23.98 5.22,23.98 J4.2
N$18  (via drill 0.7 pad 1.27)
  Top 0.305: 10.99,20.52 C18.1 | U2.2 U2.3 8.33,21.34
  Top 0.406: 8.33,21.34 v8.33,19.91 10.39,19.91 10.99,20.52
  Bottom 0.305: J4.3 6.77,25.13 8.33,23.57 v8.33,19.91
N$19
  Top 0.305: U2.9 13.32,24.43 LED2.C
N$21  (via drill 0.7 pad 1.27)
  Top 0.305: U2.16 6.51,21.96 arc45 6.3,21.44 v6.3,20.93
  Bottom 0.305: v6.3,20.93 R11.2
N$22
  Top 0.305: R12.2 5.97,25.46 arc-45 6.77,25.13 U2.12
N$23
  Top 0.254: 5.89,23.16 arc-45 6.01,23.22 U2.14
  Top 0.305: R10.2 4.45,22.25 arc45 5.35,22.62 5.89,23.16
N$24
  Top 0.305: R16.1 41.42,23.53 42.54,24.66 arc-45 42.86,24.79 43.24,24.79 LED3.A
N$28
  Top 0.305: R17.1 37.76,23.53 38.79,24.57 arc-45 38.84,24.59 arc45 LED4.A
SCL
  Top 0.305: R13.2 24.59,6.1 24.59,5.28 24.47,5.16 arc-45 24.27,5.08 22.76,5.08 22.55,4.88 22.55,4.17 J3.4 | 24.38,6.26 R13.2 | 23.98,6.34 R13.2 | 24.22,6.3 R13.2 | 24.5,6.38 R13.2 | R13.2 23.77,6.54 23.77,7.01 arc-45 23.84,7.18 arc-45 24.17,7.32 24.99,7.32 arc90 25.4,7.92 arc90 24.79,8.33 24.18,8.33 arc-90 23.77,8.74 23.77,8.91 arc-90 24.18,9.32 25.4,9.32 arc90 25.81,9.73 25.81,9.9 arc90 25.4,10.31 24.18,10.31 arc-90 23.77,10.72 23.77,10.89 arc-90 24.18,11.3 24.38,11.3 arc90 24.79,11.71 arc45 24.94,12.08 U1.32
SDA  (via drill 0.7 pad 1.27)
  Top 0.254: U1.31 v27.43,14.22
  Bottom 0.305: J3.1 15.44,4.55 arc-45 15.81,5.45 15.99,5.63 arc-45 16.63,5.89 22.28,5.89 arc45 23.44,6.37 26.17,9.1 arc45 27.43,12.15 v27.43,14.22 27.6,14.39 R14.2
UART_RX  (via drill 0.7 pad 1.27)
  Top 0.254: 26.54,19.23 U1.21
  Top 0.305: 22.42,11.24 arc45 22.07,11.39 IC1.1 | 26.54,19.23 27.67,20.35 arc-45 28.57,20.73 v29.06,20.73 | R5.2 22.42,11.24 | v23.37,12.19 22.42,11.24
  Bottom 0.305: v23.37,12.19 25.23,14.05 arc45 25.6,14.95 25.6,17.96 arc-45 25.98,18.86 27.47,20.35 arc-45 28.36,20.73 v29.06,20.73
UART_TX
  Top 0.254: U1.22 24.92,18.69 21.54,18.69
  Top 0.305: 21.54,18.69 20.89,18.05 arc45 20.73,17.64 20.73,13.8 arc-45 20.59,13.48 20.5,13.39 arc-45 20.28,13.3 IC1.4 18.67,13.3 arc45 18.17,13.09 18.07,12.99 arc45 17.88,12.54 17.88,10.55 arc45 18.25,9.65 R6.2
USB_EXTI
  Top 0.305: LED1.A 19.06,23.16 R8.1 19.16,22.72 arc45 19.33,22.33 19.54,22.11 arc45 19.95,21.95 21.98,21.95 arc-45 22.62,21.68 23.06,21.23 U1.17

### Text on the board
Top: Spiro v1.0